# Altium schematic sheet Analog_Interface.SchDoc
size A4; CompanyName: Technische Hochschule Nürnberg Georg Simon Ohm; Organization: UltraZohm; Address1: Kesslerplatz 12; Address2: 90489 Nürnberg; Address3: GERMANY; SheetNumber: 17; Website: www.ultrazohm.com
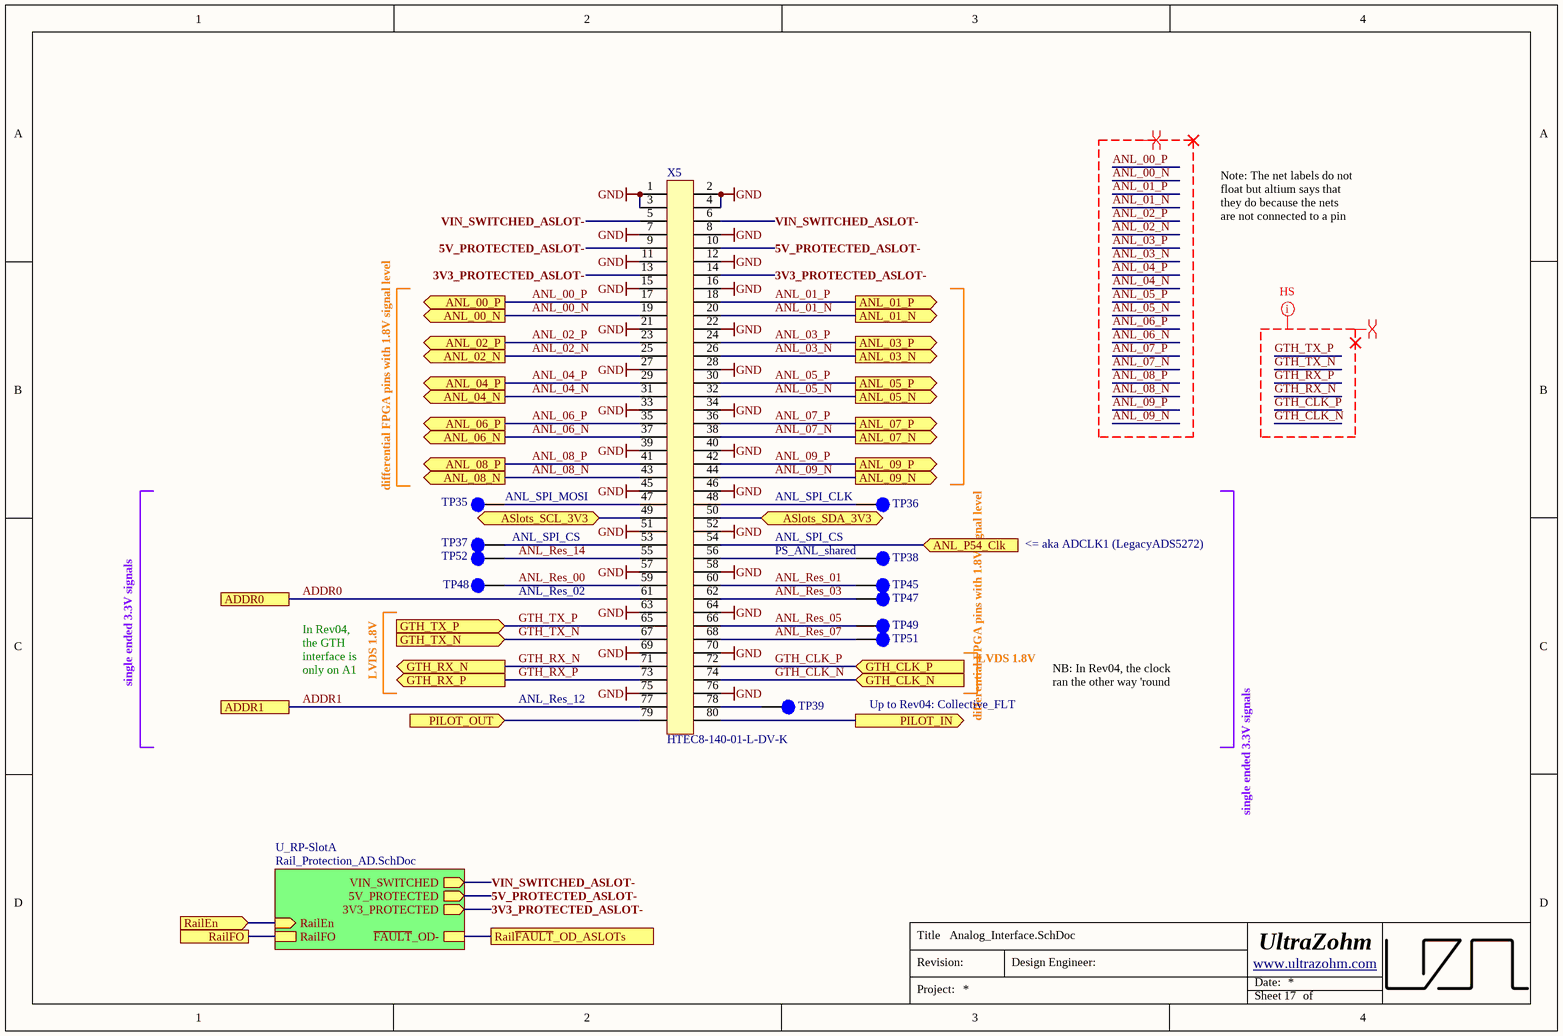
[diagram p0: Analog_Interface.SchDoc]

## Parts
TP35  Testpoint 1mm  [TP_1mm]  (value not drawn)  (no BOM)
TP36  Testpoint 1mm  [TP_1mm]  (value not drawn)  (no BOM)
TP37  Testpoint 1mm  [TP_1mm]  (value not drawn)  (no BOM)
TP38  Testpoint 1mm  [TP_1mm]  (value not drawn)  (no BOM)
TP39  Testpoint 1mm  [TP_1mm]  (value not drawn)  (no BOM)
TP45  Testpoint 1mm  [TP_1mm]  (value not drawn)  (no BOM)
TP47  Testpoint 1mm  [TP_1mm]  (value not drawn)  (no BOM)
TP48  Testpoint 1mm  [TP_1mm]  (value not drawn)  (no BOM)
TP49  Testpoint 1mm  [TP_1mm]  (value not drawn)  (no BOM)
TP51  Testpoint 1mm  [TP_1mm]  (value not drawn)  (no BOM)
TP52  Testpoint 1mm  [TP_1mm]  (value not drawn)  (no BOM)
X5  HTEC8-140-01-L-DV-K  [HTEC8-140-XX-X-DV]

## Sub-sheets
U_RP-SlotA = Rail_Protection_AD.SchDoc: RailEn (in), VIN_SWITCHED (out), ~{FAULT}_OD-, 5V_PROTECTED (out), 3V3_PROTECTED (out), RailFO

## Ports
ADDR0, ADDR1, ANL_00_N (out), ANL_00_P (out), ANL_01_N (out), ANL_01_P (out), ANL_02_N (out), ANL_02_P (out), ANL_03_N (out), ANL_03_P (out), ANL_04_N (out), ANL_04_P (out), ANL_05_N (out), ANL_05_P (out), ANL_06_N (out), ANL_06_P (out), ANL_07_N (out), ANL_07_P (out), ANL_08_N (out), ANL_08_P (out), ANL_09_N (out), ANL_09_P (out), ANL_P54_Clk (in), ASlots_SCL_3V3 (bidir), ASlots_SDA_3V3 (bidir), GTH_CLK_N (in), GTH_CLK_P (in), GTH_RX_N (out), GTH_RX_P (out), GTH_TX_N (in), GTH_TX_P (in), PILOT_IN (out), PILOT_OUT (in), RailEn (in), RailFO, Rail~{FAULT}_OD_ASLOTs

## Nets
GND: X5.1 X5.2 X5.3 X5.4 X5.7 X5.8 X5.11 X5.12 X5.15 X5.16 X5.21 X5.22 X5.27 X5.28 X5.33 X5.34 X5.39 X5.40 X5.45 X5.46 X5.51 X5.52 X5.57 X5.58 X5.63 X5.64 X5.69 X5.70 X5.75 X5.76
3V3_PROTECTED_ASLOT-: X5.13 X5.14 ; sheet U_RP-SlotA/3V3_PROTECTED
5V_PROTECTED_ASLOT-: X5.9 X5.10 ; sheet U_RP-SlotA/5V_PROTECTED
ADDR0: X5.61 ; port ADDR0
ADDR1: X5.77 ; port ADDR1
ANL_00_N: X5.19 ; port ANL_00_N
ANL_00_P: X5.17 ; port ANL_00_P
ANL_01_N: X5.20 ; port ANL_01_N
ANL_01_P: X5.18 ; port ANL_01_P
ANL_02_N: X5.25 ; port ANL_02_N
ANL_02_P: X5.23 ; port ANL_02_P
ANL_03_N: X5.26 ; port ANL_03_N
ANL_03_P: X5.24 ; port ANL_03_P
ANL_04_N: X5.31 ; port ANL_04_N
ANL_04_P: X5.29 ; port ANL_04_P
ANL_05_N: X5.32 ; port ANL_05_N
ANL_05_P: X5.30 ; port ANL_05_P
ANL_06_N: X5.37 ; port ANL_06_N
ANL_06_P: X5.35 ; port ANL_06_P
ANL_07_N: X5.38 ; port ANL_07_N
ANL_07_P: X5.36 ; port ANL_07_P
ANL_08_N: X5.43 ; port ANL_08_N
ANL_08_P: X5.41 ; port ANL_08_P
ANL_09_N: X5.44 ; port ANL_09_N
ANL_09_P: X5.42 ; port ANL_09_P
ANL_P54_Clk: X5.54 ; port ANL_P54_Clk
ANL_Res_00: TP48.1 X5.59
ANL_Res_01: TP45.1 X5.60
ANL_Res_03: TP47.1 X5.62
ANL_Res_05: TP49.1 X5.66
ANL_Res_07: TP51.1 X5.68
ANL_Res_14: TP52.1 X5.55
ASlots_SCL_3V3: X5.49 ; port ASlots_SCL_3V3
ASlots_SDA_3V3: X5.50 ; port ASlots_SDA_3V3
GTH_CLK_N: X5.74 ; port GTH_CLK_N
GTH_CLK_P: X5.72 ; port GTH_CLK_P
GTH_RX_N: X5.71 ; port GTH_RX_N
GTH_RX_P: X5.73 ; port GTH_RX_P
GTH_TX_N: X5.67 ; port GTH_TX_N
GTH_TX_P: X5.65 ; port GTH_TX_P
PILOT_IN: X5.80 ; port PILOT_IN
PILOT_OUT: X5.79 ; port PILOT_OUT
RailEn: port RailEn, sheet U_RP-SlotA/RailEn
Rail~{FAULT}_OD_ASLOTs: port Rail~{FAULT}_OD_ASLOTs, sheet U_RP-SlotA/~{FAULT}_OD-
RailFO: port RailFO, sheet U_RP-SlotA/RailFO
VIN_SWITCHED_ASLOT-: X5.5 X5.6 ; sheet U_RP-SlotA/VIN_SWITCHED
NetTP35_1: TP35.1 X5.47
NetTP36_1: TP36.1 X5.48
NetTP37_1: TP37.1 X5.53
NetTP38_1: TP38.1 X5.56
NetTP39_1: TP39.1 X5.78

## Layout directives
differential pair: ANL_00_N, ANL_00_P, ANL_01_N, ANL_01_P, ANL_02_N, ANL_02_P, ANL_03_N, ANL_03_P, ANL_04_N, ANL_04_P, ANL_05_N, ANL_05_P, ANL_06_N, ANL_06_P, ANL_07_N, ANL_07_P, ANL_08_N, ANL_08_P, ANL_09_N, ANL_09_P, GTH_CLK_N, GTH_CLK_P, GTH_RX_N, GTH_RX_P, GTH_TX_N, GTH_TX_P
net class HS: GTH_CLK_N, GTH_CLK_P, GTH_RX_N, GTH_RX_P, GTH_TX_N, GTH_TX_P

## Notes on the sheet
- Note: The net labels do not float but altium says that they do because the nets are not connected to a pin
- differential FPGA pins with 1.8V signal level
- (near TP35) ANL_SPI_MOSI
- (near TP36) ANL_SPI_CLK
- ANL_SPI_CS
- PS_ANL_shared
- <= aka ADCLK1 (LegacyADS5272)
- ANL_Res_02
- single ended 3.3V signals
- In Rev04, the GTH interface is only on A1
- LVDS 1.8V
- ANL_Res_12
- Up to Rev04: Collective_FLT
- NB: In Rev04, the clock ran the other way 'round
- Title
- Revision:
- Design Engineer:
- Date:
- Project:
- Sheet
- of

## Library data of the parts
TP35-TP39 = NULL: Manufacturer Part Number: NULL; Created from: AGeiger; Created: 2018_06_25_AGeiger; Value: Testpoint 1mm; PartID: 9; Created On: 20/09/2022 13:14:57; Component Type: Testpoint; Last Updated: 20/09/2022 13:15:39; Manufacturer: NULL; Supplier 1: NULL; Supplier Part Number 1: NULL; Type: Testpoint; Live Cycle Status: 1
TP45 TP47-TP49 TP51 TP52 = 25063: AN: 25063; Mixed: SMT
X5 = HTEC8-140-01-L-DV-K: Headers & Wire Housings 0.80 mm Rugged High-Speed Edge Card Connectors; Manufacturer: SAMTEC; Created from: AGeiger; Number of positions: 80; Manufacturer Part Number: HTEC8-140-01-L-DV-K; PartID: 23; Created On: 07/06/2024 14:27:34; ComponentLink1Description: Datasheet; ComponentLink1URL: https://suddendocs.samtec.com/catalog_english/htec8.pdf; Component Type: Board to Board Connector; Device Package: SMD; Last Updated: 09/07/2024 10:19:13; Mounting Type: SMD; Series: HTEC8; Supplier 1: SAMTEC; Supplier Part Number 1: HTEC8-140-01-L-DV-K; Type: Board to Board Connector; Live Cycle Status: 1; Stock number: not stored; Number of rows: 2; LCSC Part Number: C20365608